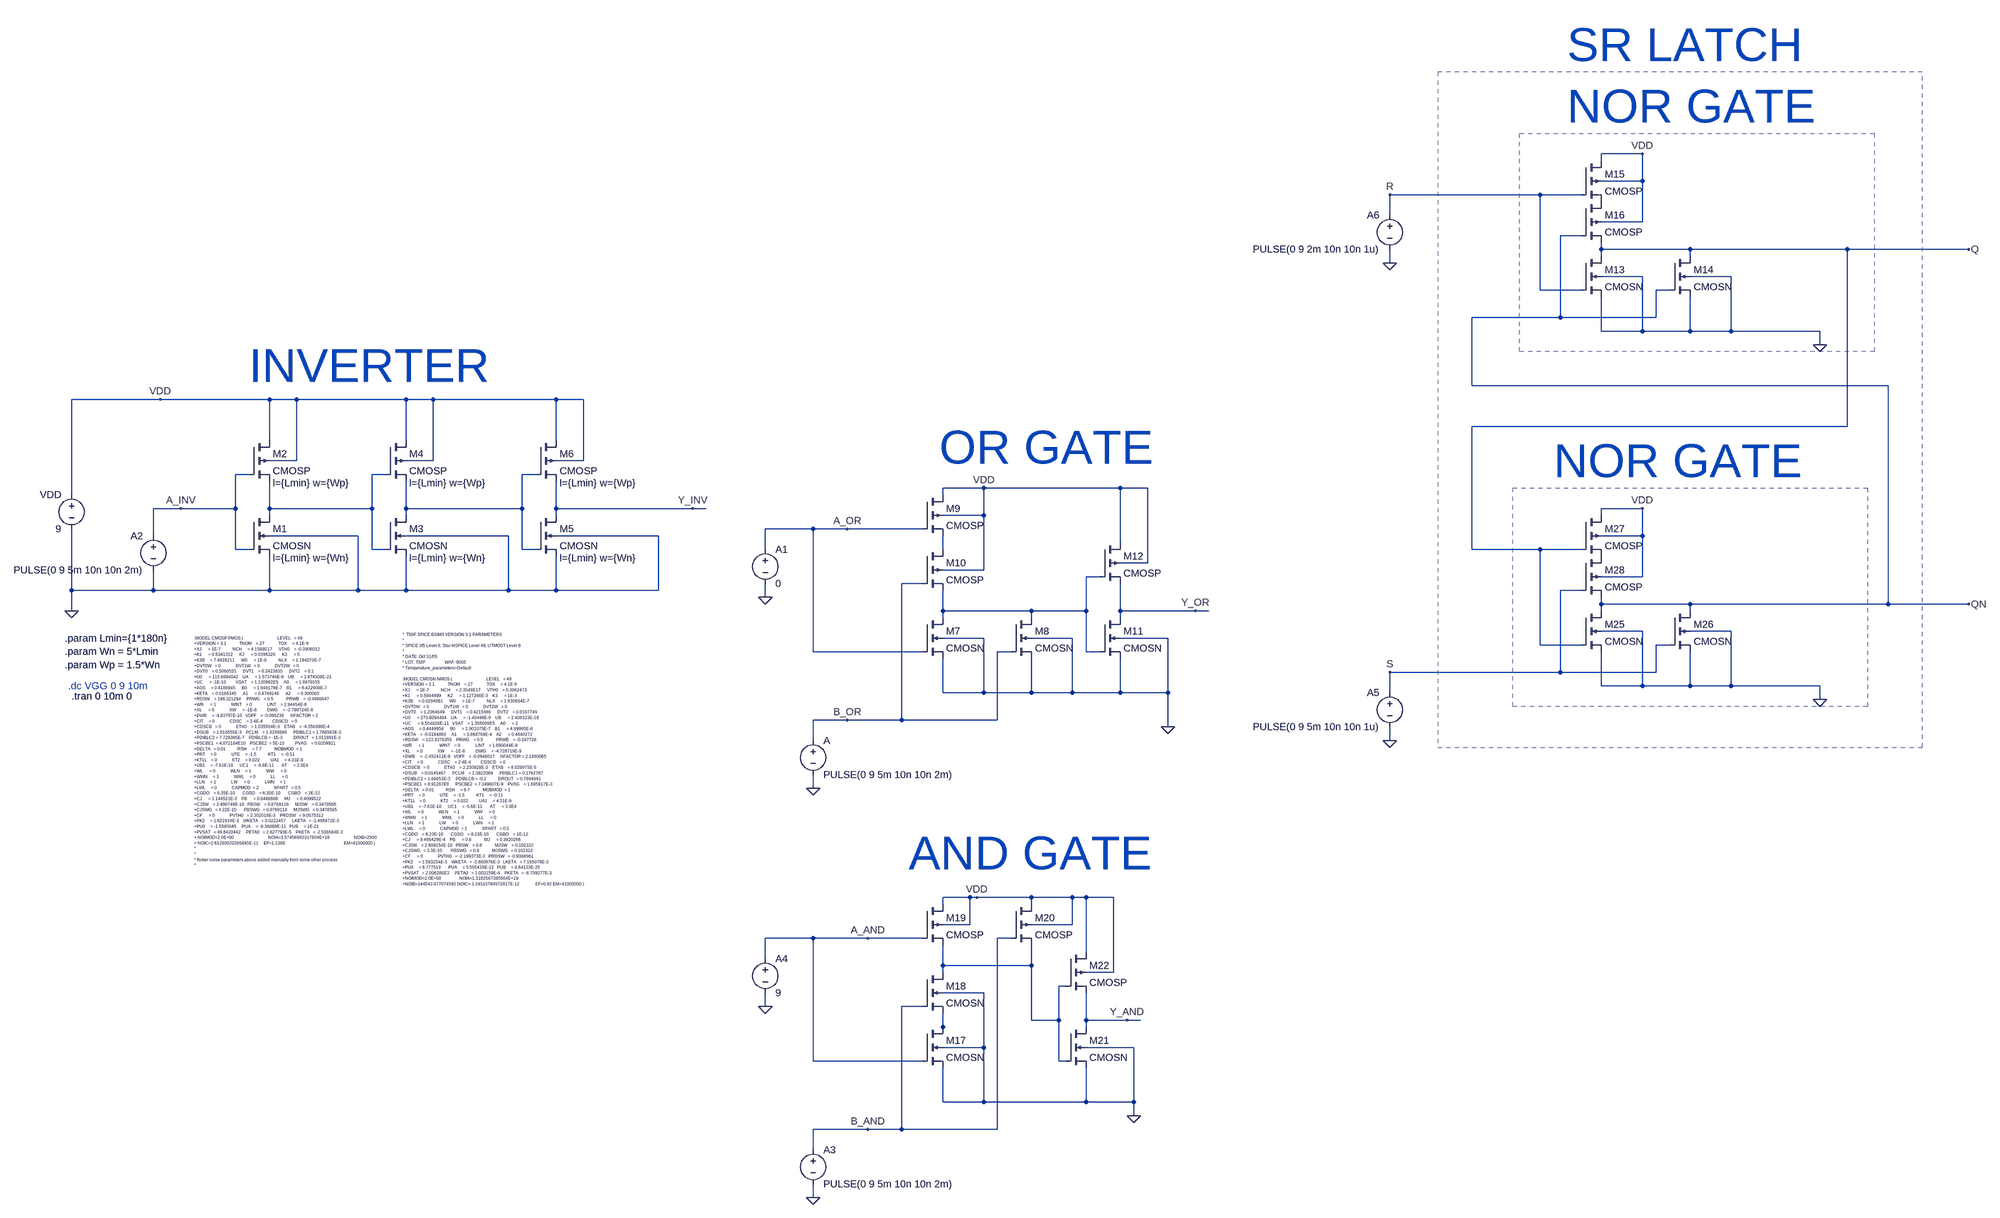
[diagram p0: schematic Logic_Gates.asc]
Logic_Gates.asc, the LTspice schematic file:
Version 4.1
SHEET 1 4520 2052
WIRE 3376 -416 3280 -416
WIRE 3280 -400 3280 -416
WIRE 3376 -352 3376 -416
WIRE 3376 -352 3280 -352
WIRE 3136 -320 2784 -320
WIRE 3232 -320 3136 -320
WIRE 2784 -272 2784 -320
WIRE 3376 -256 3376 -352
WIRE 3376 -256 3280 -256
WIRE 3232 -224 3184 -224
WIRE 3280 -192 3280 -208
WIRE 3488 -192 3280 -192
WIRE 3856 -192 3488 -192
WIRE 4144 -192 3856 -192
WIRE 3280 -176 3280 -192
WIRE 3488 -176 3488 -192
WIRE 2784 -160 2784 -192
WIRE 3376 -128 3280 -128
WIRE 3584 -128 3488 -128
WIRE 3136 -96 3136 -320
WIRE 3232 -96 3136 -96
WIRE 3440 -96 3408 -96
WIRE 3184 -32 3184 -224
WIRE 3184 -32 2976 -32
WIRE 3408 -32 3408 -96
WIRE 3408 -32 3184 -32
WIRE 3280 0 3280 -80
WIRE 3376 0 3376 -128
WIRE 3376 0 3280 0
WIRE 3488 0 3488 -80
WIRE 3488 0 3376 0
WIRE 3584 0 3584 -128
WIRE 3584 0 3488 0
WIRE 3792 0 3584 0
WIRE 3792 32 3792 0
WIRE 2976 128 2976 -32
WIRE 3952 128 2976 128
WIRE -640 160 -848 160
WIRE -384 160 -640 160
WIRE -320 160 -384 160
WIRE -64 160 -320 160
WIRE 0 160 -64 160
WIRE 288 160 0 160
WIRE 352 160 288 160
WIRE 3856 224 3856 -192
WIRE 3856 224 2976 224
WIRE -384 256 -384 160
WIRE -64 256 -64 160
WIRE 288 256 288 160
WIRE -320 304 -320 160
WIRE -320 304 -384 304
WIRE 0 304 0 160
WIRE 0 304 -64 304
WIRE 352 304 352 160
WIRE 352 304 288 304
WIRE -432 336 -464 336
WIRE -112 336 -144 336
WIRE 240 336 208 336
WIRE 1392 368 1296 368
WIRE 1712 368 1392 368
WIRE 1776 368 1712 368
WIRE -848 384 -848 160
WIRE 1296 384 1296 368
WIRE -592 416 -656 416
WIRE -464 416 -464 336
WIRE -464 416 -592 416
WIRE -384 416 -384 352
WIRE -144 416 -144 336
WIRE -144 416 -384 416
WIRE -64 416 -64 352
WIRE 208 416 208 336
WIRE 208 416 -64 416
WIRE 288 416 288 352
WIRE 608 416 288 416
WIRE 640 416 608 416
WIRE 3376 416 3280 416
WIRE -384 432 -384 416
WIRE -64 432 -64 416
WIRE 288 432 288 416
WIRE 1392 432 1392 368
WIRE 1392 432 1296 432
WIRE 3280 432 3280 416
WIRE 992 464 880 464
WIRE 1072 464 992 464
WIRE 1248 464 1072 464
WIRE -656 480 -656 416
WIRE -176 480 -384 480
WIRE 176 480 -64 480
WIRE 528 480 288 480
WIRE 3376 480 3376 416
WIRE 3376 480 3280 480
WIRE 1712 496 1712 368
WIRE -464 512 -464 416
WIRE -432 512 -464 512
WIRE -144 512 -144 416
WIRE -112 512 -144 512
WIRE 208 512 208 416
WIRE 240 512 208 512
WIRE 880 512 880 464
WIRE 1296 512 1296 480
WIRE 2976 512 2976 224
WIRE 3136 512 2976 512
WIRE 3232 512 3136 512
WIRE 1776 544 1776 368
WIRE 1776 544 1712 544
WIRE 1392 560 1392 432
WIRE 1392 560 1296 560
WIRE 1664 576 1632 576
WIRE 3376 576 3376 480
WIRE 3376 576 3280 576
WIRE 1248 592 1200 592
WIRE -848 608 -848 464
WIRE -656 608 -656 560
WIRE -656 608 -848 608
WIRE -384 608 -384 528
WIRE -384 608 -656 608
WIRE -176 608 -176 480
WIRE -176 608 -384 608
WIRE -64 608 -64 528
WIRE -64 608 -176 608
WIRE 176 608 176 480
WIRE 176 608 -64 608
WIRE 288 608 288 528
WIRE 288 608 176 608
WIRE 528 608 528 480
WIRE 528 608 288 608
WIRE 3232 608 3184 608
WIRE 880 624 880 592
WIRE 3280 640 3280 624
WIRE 3488 640 3280 640
WIRE 3952 640 3952 128
WIRE 3952 640 3488 640
WIRE 4144 640 3952 640
WIRE -848 656 -848 608
WIRE 1296 656 1296 608
WIRE 1504 656 1296 656
WIRE 1632 656 1632 576
WIRE 1632 656 1504 656
WIRE 1712 656 1712 592
WIRE 1888 656 1712 656
WIRE 1920 656 1888 656
WIRE 3280 656 3280 640
WIRE 3488 656 3488 640
WIRE 1296 672 1296 656
WIRE 1504 672 1504 656
WIRE 1712 672 1712 656
WIRE 3376 704 3280 704
WIRE 3584 704 3488 704
WIRE 1392 720 1296 720
WIRE 1600 720 1504 720
WIRE 1824 720 1712 720
WIRE 3136 736 3136 512
WIRE 3232 736 3136 736
WIRE 3440 736 3408 736
WIRE 992 752 992 464
WIRE 1248 752 992 752
WIRE 1456 752 1424 752
WIRE 1632 752 1632 656
WIRE 1664 752 1632 752
WIRE 3184 800 3184 608
WIRE 3184 800 2784 800
WIRE 3408 800 3408 736
WIRE 3408 800 3184 800
WIRE 3280 832 3280 752
WIRE 3376 832 3376 704
WIRE 3376 832 3280 832
WIRE 3488 832 3488 752
WIRE 3488 832 3376 832
WIRE 3584 832 3584 704
WIRE 3584 832 3488 832
WIRE 3792 832 3584 832
WIRE 1296 848 1296 768
WIRE 1392 848 1392 720
WIRE 1392 848 1296 848
WIRE 1504 848 1504 768
WIRE 1504 848 1392 848
WIRE 1600 848 1600 720
WIRE 1600 848 1504 848
WIRE 1712 848 1712 768
WIRE 1712 848 1600 848
WIRE 1824 848 1824 720
WIRE 1824 848 1712 848
WIRE 2784 848 2784 800
WIRE 3792 864 3792 832
WIRE 1072 912 992 912
WIRE 1200 912 1200 592
WIRE 1200 912 1072 912
WIRE 1424 912 1424 752
WIRE 1424 912 1200 912
WIRE 1824 928 1824 848
WIRE 992 960 992 912
WIRE 2784 960 2784 928
WIRE 992 1072 992 1040
WIRE 1360 1328 1296 1328
WIRE 1376 1328 1360 1328
WIRE 1504 1328 1376 1328
WIRE 1600 1328 1504 1328
WIRE 1632 1328 1600 1328
WIRE 1696 1328 1632 1328
WIRE 1296 1344 1296 1328
WIRE 1504 1344 1504 1328
WIRE 1360 1392 1360 1328
WIRE 1360 1392 1296 1392
WIRE 1600 1392 1600 1328
WIRE 1600 1392 1504 1392
WIRE 992 1424 880 1424
WIRE 1120 1424 992 1424
WIRE 1248 1424 1120 1424
WIRE 1456 1424 1424 1424
WIRE 1632 1456 1632 1328
WIRE 880 1472 880 1424
WIRE 1296 1488 1296 1440
WIRE 1504 1488 1504 1440
WIRE 1504 1488 1296 1488
WIRE 1296 1504 1296 1488
WIRE 1696 1504 1696 1328
WIRE 1696 1504 1632 1504
WIRE 1584 1536 1568 1536
WIRE 1392 1552 1296 1552
WIRE 880 1584 880 1552
WIRE 1248 1584 1200 1584
WIRE 1504 1616 1504 1488
WIRE 1568 1616 1568 1536
WIRE 1568 1616 1504 1616
WIRE 1632 1616 1632 1552
WIRE 1728 1616 1632 1616
WIRE 1760 1616 1728 1616
WIRE 1296 1632 1296 1600
WIRE 1632 1632 1632 1616
WIRE 1296 1648 1296 1632
WIRE 1392 1680 1392 1552
WIRE 1392 1680 1296 1680
WIRE 1744 1680 1632 1680
WIRE 992 1712 992 1424
WIRE 1248 1712 992 1712
WIRE 1568 1712 1568 1616
WIRE 1584 1712 1568 1712
WIRE 1296 1808 1296 1728
WIRE 1392 1808 1392 1680
WIRE 1392 1808 1296 1808
WIRE 1632 1808 1632 1728
WIRE 1632 1808 1392 1808
WIRE 1744 1808 1744 1680
WIRE 1744 1808 1632 1808
WIRE 1744 1840 1744 1808
WIRE 1120 1872 992 1872
WIRE 1200 1872 1200 1584
WIRE 1200 1872 1120 1872
WIRE 1424 1872 1424 1424
WIRE 1424 1872 1200 1872
WIRE 992 1920 992 1872
WIRE 992 2032 992 2000
FLAG -848 656 0
FLAG -640 160 VDD
FLAG 1392 368 VDD
FLAG 992 1072 0
FLAG 880 624 0
FLAG 1376 1328 VDD
FLAG 992 2032 0
FLAG 880 1584 0
FLAG 1072 464 A_OR
FLAG 1072 912 B_OR
FLAG 1888 656 Y_OR
FLAG 1728 1616 Y_AND
FLAG 1120 1424 A_AND
FLAG 1120 1872 B_AND
FLAG -592 416 A_INV
FLAG 608 416 Y_INV
FLAG 1824 928 0
FLAG 1744 1840 0
FLAG 3376 -416 VDD
FLAG 3376 416 VDD
FLAG 2784 -320 R
FLAG 2784 800 S
FLAG 4144 -192 Q
FLAG 4144 640 QN
FLAG 2784 960 0
FLAG 2784 -160 0
FLAG 3792 864 0
FLAG 3792 32 0
SYMBOL nmos4 -432 432 R0
WINDOW 123 56 100 Left 2
SYMATTR Value2 l={Lmin} w={Wn}
SYMATTR InstName M1
SYMATTR Value CMOSN
SYMBOL pmos4 -432 256 R0
WINDOW 123 56 100 Left 2
SYMATTR Value2 l={Lmin} w={Wp}
SYMATTR InstName M2
SYMATTR Value CMOSP
SYMBOL voltage -848 368 M0
WINDOW 123 0 0 Left 0
WINDOW 39 0 0 Left 0
SYMATTR InstName VDD
SYMATTR Value 9
SYMBOL nmos4 -112 432 R0
WINDOW 123 56 100 Left 2
SYMATTR Value2 l={Lmin} w={Wn}
SYMATTR InstName M3
SYMATTR Value CMOSN
SYMBOL pmos4 -112 256 R0
WINDOW 123 56 100 Left 2
SYMATTR Value2 l={Lmin} w={Wp}
SYMATTR InstName M4
SYMATTR Value CMOSP
SYMBOL nmos4 240 432 R0
WINDOW 123 56 100 Left 2
SYMATTR Value2 l={Lmin} w={Wn}
SYMATTR InstName M5
SYMATTR Value CMOSN
SYMBOL pmos4 240 256 R0
WINDOW 123 56 100 Left 2
SYMATTR Value2 l={Lmin} w={Wp}
SYMATTR InstName M6
SYMATTR Value CMOSP
SYMBOL nmos4 1248 672 R0
SYMATTR Value2 l={Lmin} w={Wn}
SYMATTR InstName M7
SYMATTR Value CMOSN
SYMBOL nmos4 1456 672 R0
SYMATTR Value2 l={Lmin} w={Wn}
SYMATTR InstName M8
SYMATTR Value CMOSN
SYMBOL pmos4 1248 384 R0
SYMATTR Value2 l={Lmin} w={Wp}
SYMATTR InstName M9
SYMATTR Value CMOSP
SYMBOL pmos4 1248 512 R0
SYMATTR Value2 l={Lmin} w={Wp}
SYMATTR InstName M10
SYMATTR Value CMOSP
SYMBOL voltage 992 944 R0
WINDOW 123 0 0 Left 0
WINDOW 39 0 0 Left 0
SYMATTR InstName A
SYMATTR Value PULSE(0 9 5m 10n 10n 2m)
SYMBOL voltage 880 496 R0
WINDOW 123 0 0 Left 0
WINDOW 39 0 0 Left 0
SYMATTR InstName A1
SYMATTR Value 0
SYMBOL voltage -656 464 M0
WINDOW 123 0 0 Left 0
WINDOW 39 0 0 Left 0
SYMATTR InstName A2
SYMATTR Value PULSE(0 9 5m 10n 10n 2m)
SYMBOL nmos4 1664 672 R0
SYMATTR Value2 l={Lmin} w={Wn}
SYMATTR InstName M11
SYMATTR Value CMOSN
SYMBOL pmos4 1664 496 R0
SYMATTR Value2 l={Lmin} w={Wp}
SYMATTR InstName M12
SYMATTR Value CMOSP
SYMBOL nmos4 1248 1632 R0
SYMATTR Value2 l={Lmin} w={Wn}
SYMATTR InstName M17
SYMATTR Value CMOSN
SYMBOL nmos4 1248 1504 R0
SYMATTR Value2 l={Lmin} w={Wn}
SYMATTR InstName M18
SYMATTR Value CMOSN
SYMBOL pmos4 1248 1344 R0
SYMATTR Value2 l={Lmin} w={Wp}
SYMATTR InstName M19
SYMATTR Value CMOSP
SYMBOL pmos4 1456 1344 R0
SYMATTR Value2 l={Lmin} w={Wp}
SYMATTR InstName M20
SYMATTR Value CMOSP
SYMBOL voltage 992 1904 R0
WINDOW 123 0 0 Left 0
WINDOW 39 0 0 Left 0
SYMATTR InstName A3
SYMATTR Value PULSE(0 9 5m 10n 10n 2m)
SYMBOL voltage 880 1456 R0
WINDOW 123 0 0 Left 0
WINDOW 39 0 0 Left 0
SYMATTR InstName A4
SYMATTR Value 9
SYMBOL nmos4 1584 1632 R0
SYMATTR Value2 l={Lmin} w={Wn}
SYMATTR InstName M21
SYMATTR Value CMOSN
SYMBOL pmos4 1584 1456 R0
SYMATTR Value2 l={Lmin} w={Wp}
SYMATTR InstName M22
SYMATTR Value CMOSP
SYMBOL nmos4 3232 -176 R0
SYMATTR Value2 l={Lmin} w={Wn}
SYMATTR InstName M13
SYMATTR Value CMOSN
SYMBOL nmos4 3440 -176 R0
SYMATTR Value2 l={Lmin} w={Wn}
SYMATTR InstName M14
SYMATTR Value CMOSN
SYMBOL pmos4 3232 -400 R0
SYMATTR Value2 l={Lmin} w={Wp}
SYMATTR InstName M15
SYMATTR Value CMOSP
SYMBOL pmos4 3232 -304 R0
SYMATTR Value2 l={Lmin} w={Wp}
SYMATTR InstName M16
SYMATTR Value CMOSP
SYMBOL nmos4 3232 656 R0
SYMATTR Value2 l={Lmin} w={Wn}
SYMATTR InstName M25
SYMATTR Value CMOSN
SYMBOL nmos4 3440 656 R0
SYMATTR Value2 l={Lmin} w={Wn}
SYMATTR InstName M26
SYMATTR Value CMOSN
SYMBOL pmos4 3232 432 R0
SYMATTR Value2 l={Lmin} w={Wp}
SYMATTR InstName M27
SYMATTR Value CMOSP
SYMBOL pmos4 3232 528 R0
SYMATTR Value2 l={Lmin} w={Wp}
SYMATTR InstName M28
SYMATTR Value CMOSP
SYMBOL voltage 2784 832 M0
WINDOW 123 0 0 Left 0
WINDOW 39 0 0 Left 0
SYMATTR InstName A5
SYMATTR Value PULSE(0 9 5m 10n 10n 1u)
SYMBOL voltage 2784 -288 M0
WINDOW 123 0 0 Left 0
WINDOW 39 0 0 Left 0
SYMATTR InstName A6
SYMATTR Value PULSE(0 9 2m 10n 10n 1u)
TEXT -560 720 Left 0 !.MODEL CMOSP PMOS (                                LEVEL   = 49\n+VERSION = 3.1            TNOM    = 27             TOX     = 4.1E-9\n+XJ      = 1E-7           NCH     = 4.1589E17      VTH0    = -0.3906012\n+K1      = 0.5341312      K2      = 0.0395326      K3      = 0\n+K3B     = 7.4916211      W0      = 1E-6           NLX     = 1.194072E-7\n+DVT0W   = 0              DVT1W   = 0              DVT2W   = 0\n+DVT0    = 0.5060555      DVT1    = 0.2423835      DVT2    = 0.1\n+U0      = 115.6894042    UA      = 1.573746E-9    UB      = 1.874308E-21\n+UC      = -1E-10         VSAT    = 1.130982E5     A0      = 1.9976555\n+AGS     = 0.4186945      B0      = 1.949178E-7    B1      = 6.422908E-7\n+KETA    = 0.0166345      A1      = 0.4749146      A2      = 0.300003\n+RDSW    = 198.321294     PRWG    = 0.5            PRWB    = -0.4986647\n+WR      = 1              WINT    = 0              LINT    = 2.94454E-8\n+XL      = 0              XW      = -1E-8          DWG     = -2.798724E-8\n+DWB     = -4.83797E-10   VOFF    = -0.095236      NFACTOR = 2\n+CIT     = 0              CDSC    = 2.4E-4         CDSCD   = 0\n+CDSCB   = 0              ETA0    = 1.035504E-3    ETAB    = -4.358398E-4\n+DSUB    = 1.816555E-3    PCLM    = 1.3299898      PDIBLC1 = 1.766563E-3\n+PDIBLC2 = 7.728395E-7    PDIBLCB = -1E-3          DROUT   = 1.011891E-3\n+PSCBE1  = 4.872184E10    PSCBE2  = 5E-10          PVAG    = 0.0209921\n+DELTA   = 0.01           RSH     = 7.7            MOBMOD  = 1\n+PRT     = 0              UTE     = -1.5           KT1     = -0.11\n+KT1L    = 0              KT2     = 0.022          UA1     = 4.31E-9\n+UB1     = -7.61E-18      UC1     = -5.6E-11       AT      = 3.3E4\n+WL      = 0              WLN     = 1              WW      = 0\n+WWN     = 1              WWL     = 0              LL      = 0\n+LLN     = 1              LW      = 0              LWN     = 1\n+LWL     = 0              CAPMOD  = 2              XPART   = 0.5\n+CGDO    = 6.35E-10       CGSO    = 6.35E-10       CGBO    = 1E-12\n+CJ      = 1.144521E-3    PB      = 0.8468686      MJ      = 0.4099522\n+CJSW    = 2.490749E-10   PBSW    = 0.8769118      MJSW    = 0.3478565\n+CJSWG   = 4.22E-10       PBSWG   = 0.8769118      MJSWG   = 0.3478565\n+CF      = 0              PVTH0   = 2.302018E-3    PRDSW   = 9.0575312\n+PK2     = 1.821914E-3    WKETA   = 0.0222457      LKETA   = -1.495872E-3\n+PU0     = -1.5580645     PUA     = -6.36889E-11   PUB     = 1E-21\n+PVSAT   = 49.8420442     PETA0   = 2.827793E-5    PKETA   = -2.536564E-3 \n+ NOIMOD=2.0E+00                                NOIA=3.57456993317604E+18                       NOIB=2500\n+ NOIC=2.61260020285845E-11     EF=1.1388                                                       EM=41000000 )\n*\n*\n* flicker noise parameters above added manually from some other process\n*
TEXT -864 720 Left 2 !.param Lmin={1*180n}\n.param Wn = 5*Lmin\n.param Wp = 1.5*Wn
TEXT -856 832 Left 2 ;.dc VGG 0 9 10m
TEXT -72 712 Left 0 !*  T58F SPICE BSIM3 VERSION 3.1 PARAMETERS\n* \n* SPICE 3f5 Level 8, Star-HSPICE Level 49, UTMOST Level 8\n* \n* DATE: Oct 31/05\n* LOT: T58F                  WAF: 9005\n* Temperature_parameters=Default\n \n.MODEL CMOSN NMOS (                                LEVEL   = 49\n+VERSION = 3.1            TNOM    = 27             TOX     = 4.1E-9\n+XJ      = 1E-7           NCH     = 2.3549E17      VTH0    = 0.3662473\n+K1      = 0.5864999      K2      = 1.127266E-3    K3      = 1E-3\n+K3B     = 0.0294061      W0      = 1E-7           NLX     = 1.630684E-7\n+DVT0W   = 0              DVT1W   = 0              DVT2W   = 0\n+DVT0    = 1.2064649      DVT1    = 0.4215486      DVT2    = 0.0197749\n+U0      = 273.8094484    UA      = -1.40499E-9    UB      = 2.408323E-18\n+UC      = 6.504826E-11   VSAT    = 1.355009E5     A0      = 2\n+AGS     = 0.4449958      B0      = 1.901075E-7    B1      = 4.99995E-6\n+KETA    = -0.0164863     A1      = 3.868769E-4    A2      = 0.4640272\n+RDSW    = 123.3376355    PRWG    = 0.5            PRWB    = -0.197728\n+WR      = 1              WINT    = 0              LINT    = 1.690044E-8\n+XL      = 0              XW      = -1E-8          DWG     = -4.728719E-9\n+DWB     = -2.452411E-9   VOFF    = -0.0948017     NFACTOR = 2.1860065\n+CIT     = 0              CDSC    = 2.4E-4         CDSCD   = 0\n+CDSCB   = 0              ETA0    = 2.230928E-3    ETAB    = 6.028975E-5\n+DSUB    = 0.0145467      PCLM    = 1.3822069      PDIBLC1 = 0.1762787\n+PDIBLC2 = 1.66653E-3     PDIBLCB = -0.1           DROUT   = 0.7694691\n+PSCBE1  = 8.91287E9      PSCBE2  = 7.349607E-9    PVAG    = 1.685917E-3\n+DELTA   = 0.01           RSH     = 6.7            MOBMOD  = 1\n+PRT     = 0              UTE     = -1.5           KT1     = -0.11\n+KT1L    = 0              KT2     = 0.022          UA1     = 4.31E-9\n+UB1     = -7.61E-18      UC1     = -5.6E-11       AT      = 3.3E4\n+WL      = 0              WLN     = 1              WW      = 0\n+WWN     = 1              WWL     = 0              LL      = 0\n+LLN     = 1              LW      = 0              LWN     = 1\n+LWL     = 0              CAPMOD  = 2              XPART   = 0.5\n+CGDO    = 8.23E-10       CGSO    = 8.23E-10       CGBO    = 1E-12\n+CJ      = 9.466429E-4    PB      = 0.8            MJ      = 0.3820266\n+CJSW    = 2.608154E-10   PBSW    = 0.8            MJSW    = 0.102322\n+CJSWG   = 3.3E-10        PBSWG   = 0.8            MJSWG   = 0.102322\n+CF      = 0              PVTH0   = -2.199373E-3   PRDSW   = -0.9368961\n+PK2     = 1.593254E-3    WKETA   = -2.880976E-3   LKETA   = 7.165078E-3\n+PU0     = 6.777519       PUA     = 5.505418E-12   PUB     = 8.84133E-25\n+PVSAT   = 2.006286E3     PETA0   = 1.003159E-4    PKETA   = -6.759277E-3\n+NOIMOD=2.0E+00                 NOIA=1.3182567385564E+19\n+NOIB=144543.977074592 NOIC=-1.24515784572817E-12               EF=0.92 EM=41000000 )
TEXT -432 80 Left 7 ;INVERTER
TEXT -848 856 Left 2 !.tran 0 10m 0
TEXT 1288 272 Left 7 ;OR GATE
TEXT 1216 1224 Left 7 ;AND GATE
TEXT 3200 -528 Left 7 ;NOR GATE
TEXT 3168 304 Left 7 ;NOR GATE
TEXT 3200 -672 Left 7 ;SR LATCH
RECTANGLE Normal 3920 48 3088 -464 2
RECTANGLE Normal 3904 880 3072 368 2
RECTANGLE Normal 4032 -608 2896 976 2

The netlist it stands for:
* Logic_Gates.asc
M1 N001 A_INV 0 0 CMOSN l={Lmin} w={Wn}
M2 VDD A_INV N001 VDD CMOSP l={Lmin} w={Wp}
VDD VDD 0 9
M3 N002 N001 0 0 CMOSN l={Lmin} w={Wn}
M4 VDD N001 N002 VDD CMOSP l={Lmin} w={Wp}
M5 Y_INV N002 0 0 CMOSN l={Lmin} w={Wn}
M6 VDD N002 Y_INV VDD CMOSP l={Lmin} w={Wp}
M7 N004 A_OR 0 0 CMOSN l={Lmin} w={Wn}
M8 N004 B_OR 0 0 CMOSN l={Lmin} w={Wn}
M9 VDD A_OR N003 VDD CMOSP l={Lmin} w={Wp}
M10 N003 B_OR N004 VDD CMOSP l={Lmin} w={Wp}
V§A B_OR 0 PULSE(0 9 5m 10n 10n 2m)
V§A1 A_OR 0 0
V§A2 A_INV 0 PULSE(0 9 5m 10n 10n 2m)
M11 Y_OR N004 0 0 CMOSN l={Lmin} w={Wn}
M12 VDD N004 Y_OR VDD CMOSP l={Lmin} w={Wp}
M17 N006 A_AND 0 0 CMOSN l={Lmin} w={Wn}
M18 N005 B_AND N006 0 CMOSN l={Lmin} w={Wn}
M19 VDD A_AND N005 VDD CMOSP l={Lmin} w={Wp}
M20 VDD B_AND N005 VDD CMOSP l={Lmin} w={Wp}
V§A3 B_AND 0 PULSE(0 9 5m 10n 10n 2m)
V§A4 A_AND 0 9
M21 Y_AND N005 0 0 CMOSN l={Lmin} w={Wn}
M22 VDD N005 Y_AND VDD CMOSP l={Lmin} w={Wp}
M13 Q R 0 0 CMOSN l={Lmin} w={Wn}
M14 Q QN 0 0 CMOSN l={Lmin} w={Wn}
M15 VDD R P001 VDD CMOSP l={Lmin} w={Wp}
M16 P001 QN Q VDD CMOSP l={Lmin} w={Wp}
M25 QN Q 0 0 CMOSN l={Lmin} w={Wn}
M26 QN S 0 0 CMOSN l={Lmin} w={Wn}
M27 VDD Q P002 VDD CMOSP l={Lmin} w={Wp}
M28 P002 S QN VDD CMOSP l={Lmin} w={Wp}
V§A5 S 0 PULSE(0 9 5m 10n 10n 1u)
V§A6 R 0 PULSE(0 9 2m 10n 10n 1u)
.model NMOS NMOS
.model PMOS PMOS
.lib standard.mos
.MODEL CMOSP PMOS (                                LEVEL   = 49
+VERSION = 3.1            TNOM    = 27             TOX     = 4.1E-9
+XJ      = 1E-7           NCH     = 4.1589E17      VTH0    = -0.3906012
+K1      = 0.5341312      K2      = 0.0395326      K3      = 0
+K3B     = 7.4916211      W0      = 1E-6           NLX     = 1.194072E-7
+DVT0W   = 0              DVT1W   = 0              DVT2W   = 0
+DVT0    = 0.5060555      DVT1    = 0.2423835      DVT2    = 0.1
+U0      = 115.6894042    UA      = 1.573746E-9    UB      = 1.874308E-21
+UC      = -1E-10         VSAT    = 1.130982E5     A0      = 1.9976555
+AGS     = 0.4186945      B0      = 1.949178E-7    B1      = 6.422908E-7
+KETA    = 0.0166345      A1      = 0.4749146      A2      = 0.300003
+RDSW    = 198.321294     PRWG    = 0.5            PRWB    = -0.4986647
+WR      = 1              WINT    = 0              LINT    = 2.94454E-8
+XL      = 0              XW      = -1E-8          DWG     = -2.798724E-8
+DWB     = -4.83797E-10   VOFF    = -0.095236      NFACTOR = 2
+CIT     = 0              CDSC    = 2.4E-4         CDSCD   = 0
+CDSCB   = 0              ETA0    = 1.035504E-3    ETAB    = -4.358398E-4
+DSUB    = 1.816555E-3    PCLM    = 1.3299898      PDIBLC1 = 1.766563E-3
+PDIBLC2 = 7.728395E-7    PDIBLCB = -1E-3          DROUT   = 1.011891E-3
+PSCBE1  = 4.872184E10    PSCBE2  = 5E-10          PVAG    = 0.0209921
+DELTA   = 0.01           RSH     = 7.7            MOBMOD  = 1
+PRT     = 0              UTE     = -1.5           KT1     = -0.11
+KT1L    = 0              KT2     = 0.022          UA1     = 4.31E-9
+UB1     = -7.61E-18      UC1     = -5.6E-11       AT      = 3.3E4
+WL      = 0              WLN     = 1              WW      = 0
+WWN     = 1              WWL     = 0              LL      = 0
+LLN     = 1              LW      = 0              LWN     = 1
+LWL     = 0              CAPMOD  = 2              XPART   = 0.5
+CGDO    = 6.35E-10       CGSO    = 6.35E-10       CGBO    = 1E-12
+CJ      = 1.144521E-3    PB      = 0.8468686      MJ      = 0.4099522
+CJSW    = 2.490749E-10   PBSW    = 0.8769118      MJSW    = 0.3478565
+CJSWG   = 4.22E-10       PBSWG   = 0.8769118      MJSWG   = 0.3478565
+CF      = 0              PVTH0   = 2.302018E-3    PRDSW   = 9.0575312
+PK2     = 1.821914E-3    WKETA   = 0.0222457      LKETA   = -1.495872E-3
+PU0     = -1.5580645     PUA     = -6.36889E-11   PUB     = 1E-21
+PVSAT   = 49.8420442     PETA0   = 2.827793E-5    PKETA   = -2.536564E-3
+ NOIMOD=2.0E+00                                NOIA=3.57456993317604E+18                       NOIB=2500
+ NOIC=2.61260020285845E-11     EF=1.1388                                                       EM=41000000 )
*
*
* flicker noise parameters above added manually from some other process
*
.param Lmin={1*180n}
.param Wn = 5*Lmin
.param Wp = 1.5*Wn
* .dc VGG 0 9 10m
*  T58F SPICE BSIM3 VERSION 3.1 PARAMETERS
*
* SPICE 3f5 Level 8, Star-HSPICE Level 49, UTMOST Level 8
*
* DATE: Oct 31/05
* LOT: T58F                  WAF: 9005
* Temperature_parameters=Default
.MODEL CMOSN NMOS (                                LEVEL   = 49
+VERSION = 3.1            TNOM    = 27             TOX     = 4.1E-9
+XJ      = 1E-7           NCH     = 2.3549E17      VTH0    = 0.3662473
+K1      = 0.5864999      K2      = 1.127266E-3    K3      = 1E-3
+K3B     = 0.0294061      W0      = 1E-7           NLX     = 1.630684E-7
+DVT0W   = 0              DVT1W   = 0              DVT2W   = 0
+DVT0    = 1.2064649      DVT1    = 0.4215486      DVT2    = 0.0197749
+U0      = 273.8094484    UA      = -1.40499E-9    UB      = 2.408323E-18
+UC      = 6.504826E-11   VSAT    = 1.355009E5     A0      = 2
+AGS     = 0.4449958      B0      = 1.901075E-7    B1      = 4.99995E-6
+KETA    = -0.0164863     A1      = 3.868769E-4    A2      = 0.4640272
+RDSW    = 123.3376355    PRWG    = 0.5            PRWB    = -0.197728
+WR      = 1              WINT    = 0              LINT    = 1.690044E-8
+XL      = 0              XW      = -1E-8          DWG     = -4.728719E-9
+DWB     = -2.452411E-9   VOFF    = -0.0948017     NFACTOR = 2.1860065
+CIT     = 0              CDSC    = 2.4E-4         CDSCD   = 0
+CDSCB   = 0              ETA0    = 2.230928E-3    ETAB    = 6.028975E-5
+DSUB    = 0.0145467      PCLM    = 1.3822069      PDIBLC1 = 0.1762787
+PDIBLC2 = 1.66653E-3     PDIBLCB = -0.1           DROUT   = 0.7694691
+PSCBE1  = 8.91287E9      PSCBE2  = 7.349607E-9    PVAG    = 1.685917E-3
+DELTA   = 0.01           RSH     = 6.7            MOBMOD  = 1
+PRT     = 0              UTE     = -1.5           KT1     = -0.11
+KT1L    = 0              KT2     = 0.022          UA1     = 4.31E-9
+UB1     = -7.61E-18      UC1     = -5.6E-11       AT      = 3.3E4
+WL      = 0              WLN     = 1              WW      = 0
+WWN     = 1              WWL     = 0              LL      = 0
+LLN     = 1              LW      = 0              LWN     = 1
+LWL     = 0              CAPMOD  = 2              XPART   = 0.5
+CGDO    = 8.23E-10       CGSO    = 8.23E-10       CGBO    = 1E-12
+CJ      = 9.466429E-4    PB      = 0.8            MJ      = 0.3820266
+CJSW    = 2.608154E-10   PBSW    = 0.8            MJSW    = 0.102322
+CJSWG   = 3.3E-10        PBSWG   = 0.8            MJSWG   = 0.102322
+CF      = 0              PVTH0   = -2.199373E-3   PRDSW   = -0.9368961
+PK2     = 1.593254E-3    WKETA   = -2.880976E-3   LKETA   = 7.165078E-3
+PU0     = 6.777519       PUA     = 5.505418E-12   PUB     = 8.84133E-25
+PVSAT   = 2.006286E3     PETA0   = 1.003159E-4    PKETA   = -6.759277E-3
+NOIMOD=2.0E+00                 NOIA=1.3182567385564E+19
+NOIB=144543.977074592 NOIC=-1.24515784572817E-12               EF=0.92 EM=41000000 )
* INVERTER
.tran 0 10m 0
* OR GATE
* AND GATE
* NOR GATE
* NOR GATE
* SR LATCH
.backanno
.end